# Altium schematic sheet CarrierPeripherals.SchDoc
size A3; SheetNumber: 3; SheetTotal: 3
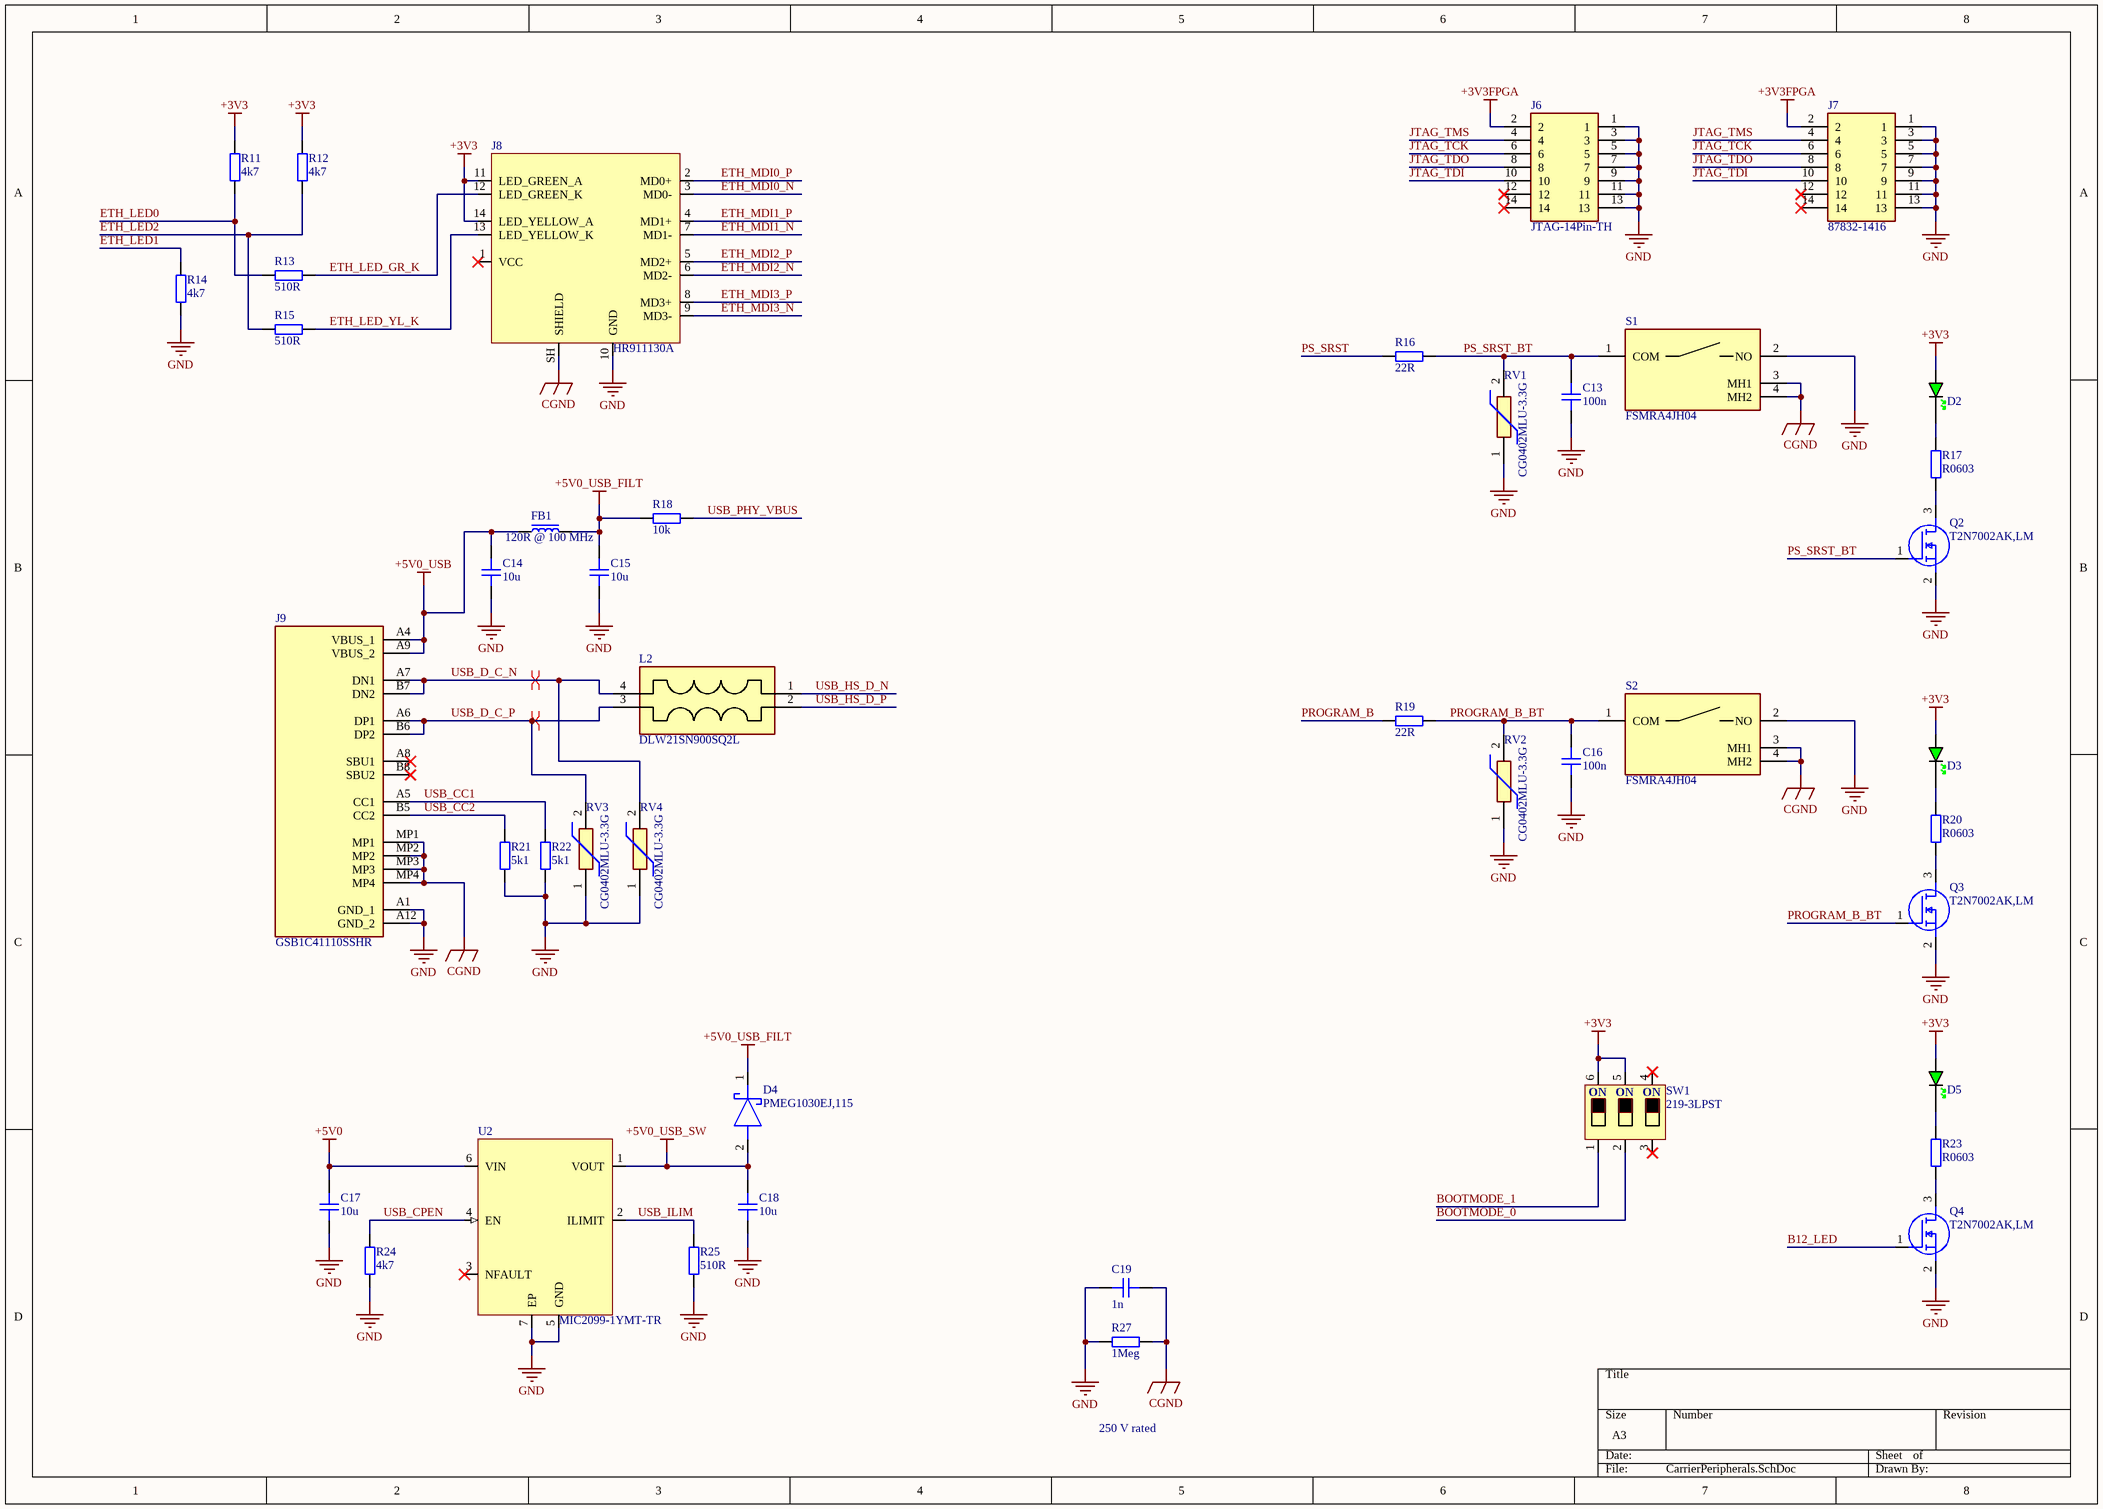
[diagram p0: CarrierPeripherals.SchDoc]

## Parts
C13  100n  [CAP_0402]
C14  10u  [CAP_0603]
C15  10u  [CAP_0603]
C16  100n  [CAP_0402]
C17  10u  [CAP_0603]
C18  10u  [CAP_0603]
C19  1n  [CAP_1206]
D2  GREEN  [LED_0603_GREEN]  (value not drawn)
D3  GREEN  [LED_0603_GREEN]  (value not drawn)
D4  PMEG1030EJ,115  [PMEG1030EJ115]
D5  GREEN  [LED_0603_GREEN]  (value not drawn)
FB1  120R @ 100 MHz  [FB_0603]
J6  JTAG-14Pin-TH  [14Pin-TH]
J7  87832-1416  [878321416]
J8  HR911130A  [HR911130A]
J9  GSB1C41110SSHR  [GSB1C41110SSHR]
L2  DLW21SN900SQ2L  [DLW21SN121HQ2L]
Q2  T2N7002AK,LM  [TBAT54CLM]
Q3  T2N7002AK,LM  [TBAT54CLM]
Q4  T2N7002AK,LM  [TBAT54CLM]
R11  4k7  [RES_0402]
R12  4k7  [RES_0402]
R13  510R  [RES_0603]
R14  4k7  [RES_0402]
R15  510R  [RES_0603]
R16  22R  [RES_0402]
R17  R0603  [RES_0603]
R18  10k  [RES_0402]
R19  22R  [RES_0402]
R20  R0603  [RES_0603]
R21  5k1  [RES_0402]
R22  5k1  [RES_0402]
R23  R0603  [RES_0603]
R24  4k7  [RES_0402]
R25  510R  [RES_0603]
R27  1Meg  [RES_1206]
RV1  CG0402MLU-3.3G  [VARC1005X41N]
RV2  CG0402MLU-3.3G  [VARC1005X41N]
RV3  CG0402MLU-3.3G  [VARC1005X41N]
RV4  CG0402MLU-3.3G  [VARC1005X41N]
S1  FSMRA4JH04  [FSMRA4JH04]
S2  FSMRA4JH04  [FSMRA4JH04]
SW1  219-3LPST  [219-3LPST]
U2  MIC2099-1YMT-TR  [TMLF-6-1_6X1_6]

## Nets
+3V3: D2.A D3.A D5.A J8.11(LED_GREEN_A) J8.14(LED_YELLOW_A) R11.2 R12.2 SW1.5 SW1.6
+3V3FPGA: J6.2 J7.2
+5V0: C17.2 U2.6(VIN)
+5V0_USB: C14.2 FB1.1 J9.A4(VBUS_1) J9.A9(VBUS_2)
+5V0_USB_FILT: C15.2 D4.1(K) FB1.2 R18.1
+5V0_USB_SW: C18.2 D4.2(A) U2.1(VOUT)
CGND: C19.2 J8.SH(SHIELD) J9.MP1 J9.MP2 J9.MP3 J9.MP4 R27.2 S1.3(MH1) S1.4(MH2) S2.3(MH1) S2.4(MH2)
GND: C13.1 C14.1 C15.1 C16.1 C17.1 C18.1 C19.1 J6.1 J6.3 J6.5 J6.7 J6.9 J6.11 J6.13 J7.1 J7.3 J7.5 J7.7 J7.9 J7.11 J7.13 J8.10(GND) J9.A1(GND_1) J9.A12(GND_2) Q2.2(S) Q3.2(S) Q4.2(S) R14.1 R21.1 R22.1 R24.1 R25.1 R27.1 RV1.1 RV2.1 RV3.1 RV4.1 S1.2(NO) S2.2(NO) U2.5(GND) U2.7(EP)
B12_LED: Q4.1(G)
BOOTMODE_0: SW1.2
BOOTMODE_1: SW1.1
ETH_LED0: R11.1 R13.1
ETH_LED1: R14.2
ETH_LED2: R12.1 R15.2
ETH_LED_GR_K: J8.12(LED_GREEN_K) R13.2
ETH_LED_YL_K: J8.13(LED_YELLOW_K) R15.1
ETH_MDI0_N: J8.3(MD0-)
ETH_MDI0_P: J8.2(MD0+)
ETH_MDI1_N: J8.7(MD1-)
ETH_MDI1_P: J8.4(MD1+)
ETH_MDI2_N: J8.6(MD2-)
ETH_MDI2_P: J8.5(MD2+)
ETH_MDI3_N: J8.9(MD3-)
ETH_MDI3_P: J8.8(MD3+)
JTAG_TCK: J6.6 J7.6
JTAG_TDI: J6.10 J7.10
JTAG_TDO: J6.8 J7.8
JTAG_TMS: J6.4 J7.4
PROGRAM_B: R19.2
PROGRAM_B_BT: C16.2 Q3.1(G) R19.1 RV2.2 S2.1(COM)
PS_SRST: R16.2
PS_SRST_BT: C13.2 Q2.1(G) R16.1 RV1.2 S1.1(COM)
USB_CC1: J9.A5(CC1) R22.2
USB_CC2: J9.B5(CC2) R21.2
USB_CPEN: R24.2 U2.4(EN)
USB_D_C_N: J9.A7(DN1) J9.B7(DN2) L2.4 RV4.2
USB_D_C_P: J9.A6(DP1) J9.B6(DP2) L2.3 RV3.2
USB_HS_D_N: L2.1
USB_HS_D_P: L2.2
USB_ILIM: R25.2 U2.2(ILIMIT)
USB_PHY_VBUS: R18.2
NetD2_K: D2.K R17.2
NetD3_K: D3.K R20.2
NetD5_K: D5.K R23.2
NetQ2_3: Q2.3(D) R17.1
NetQ3_3: Q3.3(D) R20.1
NetQ4_3: Q4.3(D) R23.1

Not connected (* = marked no-connect by the designer): J6 12* 14*; J7 12* 14*; J8 1(VCC)*; J9 A8(SBU1)* B8(SBU2)*; SW1 3* 4*; U2 3(NFAULT)*

## Layout directives
differential pair: USB_D_C_N, USB_D_C_P

## Notes on the sheet
- 250 V rated
- (in symbol 219-3LPST) ON

## Library data of the parts
C13 C16 = CAP_0402: Capacitor SMD 0402; Manufacturer: *; Manufacturer Part Number: *; Distributor Link: *; LCSC: *; Rating: *; Dielectric: *
C14 C15 C17 C18 = CAP_0603: Capacitor SMD 0603; Manufacturer: *; Manufacturer Part Number: *; Distributor Link: *; LCSC: *; Rating: *; Dielectric: *
C19 = CAP_1206: Capacitor SMD 1206; Manufacturer: *; Manufacturer Part Number: *; Distributor Link: *; LCSC: *; Rating: *; Dielectric: *
D2 D3 D5 = LED_0603_GREEN: LED 0603 GREEN SMD
D4 = PMEG1030EJ,115: Schottky Diode; Manufacturer_Name: Nexperia; Datasheet Link: https://assets.nexperia.com/documents/data-sheet/PMEG1030EH_EJ.pdf; Height: 0.8mm; Manufacturer_Part_Number: PMEG1030EJ,115; Mouser Part Number: 771-PMEG1030EJ-T/R; Mouser Price/Stock: https://www.mouser.co.uk/ProductDetail/Nexperia/PMEG1030EJ115?qs=LOCUfHb8d9vmk7P%2FuYbs5A%3D%3D; Arrow Part Number: PMEG1030EJ,115; Arrow Price/Stock: https://www.arrow.com/en/products/pmeg1030ej115/nexperia?utm_currency=USD&region=nac
FB1 = FB_0603: Ferrite Bead SMD 0603; Manufacturer: *; Manufacturer Part Number: *; Distributor Link: *; LCSC: *
J6 = JTAG-14Pin-TH: Connector; Manufacturer_Name: Molex; Manufacturer_Part_Number: 87832-1416; Datasheet Link: http://uk.rs-online.com/web/p/products/6701077; Height: 7.6mm; Mouser Part Number: 538-87832-1416; Mouser Price/Stock: https://www.mouser.co.uk/ProductDetail/Molex/87832-1416?qs=kNSQ05%252BLZoDeXuSWsnDgxQ%3D%3D
J7 = 87832-1416: Connector; Manufacturer_Name: Molex; Datasheet Link: http://uk.rs-online.com/web/p/products/6701077; Height: 7.6mm; Manufacturer_Part_Number: 87832-1416; Mouser Part Number: 538-87832-1416; Mouser Price/Stock: https://www.mouser.co.uk/ProductDetail/Molex/87832-1416?qs=kNSQ05%252BLZoDeXuSWsnDgxQ%3D%3D
J8 = HR911130A: 100/1000Base-T Magnetics Single-Port RJ45 Connector with Integrated Magnetics and LEDs; Manufacturer: Hanrun; Manufacturer Part Number: HR911130A
J9 = GSB1C41110SSHR: Connector; Manufacturer_Name: Amphenol Communications Solutions; Datasheet Link: https://cdn.amphenol-cs.com/media/wysiwyg/files/drawing/gsb1c41x10sshr-ax1.pdf; Height: 3.41mm; Manufacturer_Part_Number: GSB1C41110SSHR
L2 = DLW21SN900SQ2L: Inductor; Manufacturer_Name: Murata Electronics; Datasheet Link: https://datasheet.datasheetarchive.com/originals/distributors/Datasheets_SAMA/ece8820704b5ec0ab68e5b2fda1b5649.pdf; Height: 1.4mm; Manufacturer_Part_Number: DLW21SN900SQ2L; Mouser Part Number: 81-DLW21SN900SQ2L; Mouser Price/Stock: https://www.mouser.co.uk/ProductDetail/Murata-Electronics/DLW21SN900SQ2L?qs=yQ3nQrcaeVsNzdZbwxOhwQ%3D%3D; Arrow Part Number: DLW21SN900SQ2L; Arrow Price/Stock: https://www.arrow.com/en/products/dlw21sn900sq2l/murata-manufacturing?region=europe
Q2-Q4 = T2N7002AK,LM: MOSFET (N-Channel); Manufacturer_Name: Toshiba; Datasheet Link: http://toshiba.semicon-storage.com/info/docget.jsp?did=29712&prodName=T2N7002AK; Height: 1.1mm; Manufacturer_Part_Number: T2N7002AK,LM; Mouser Part Number: 757-T2N7002AKLM; Mouser Price/Stock: https://www.mouser.co.uk/ProductDetail/Toshiba/T2N7002AKLM?qs=pzVvXTvk9PzfX4hYglwZ9Q%3D%3D; Arrow Part Number: T2N7002AK,LM; Arrow Price/Stock: https://www.arrow.com/en/products/t2n7002aklm/toshiba?region=nac
R11 R12 R14 R16 R18 R19 R21 R22 R24 = RES_0402: Resistor SMD 0402; Manufacturer: *; Manufacturer Part Number: *; Distributor Link: *; LCSC: *
R13 R15 R17 R20 R23 R25 = RES_0603: Resistor SMD 0603; Manufacturer: *; Manufacturer Part Number: *; Distributor Link: *; LCSC: *
R27 = RES_1206: Resistor SMD 1206; Manufacturer: *; Manufacturer Part Number: *; Distributor Link: *; LCSC: *
RV1-RV4 = CG0402MLU-3.3G: ESD Diode; Manufacturer_Name: Bourns; Datasheet Link: https://www.bourns.com/docs/Product-Datasheets/MLU.pdf; Height: 0.41mm; Manufacturer_Part_Number: CG0402MLU-3.3G; Mouser Part Number: 652-CG0402MLU-3.3G; Mouser Price/Stock: https://www.mouser.co.uk/ProductDetail/Bourns/CG0402MLU-3.3G?qs=m8myXnDJXpWVM8EQWErxtQ%3D%3D; Arrow Part Number: CG0402MLU-3.3G; Arrow Price/Stock: https://www.arrow.com/en/products/cg0402mlu-3.3g/bourns?utm_currency=USD&region=nac
S1 S2 = FSMRA4JH04: Switch; Manufacturer_Name: TE Connectivity; Datasheet Link: http://www.te.com/commerce/DocumentDelivery/DDEController?Action=showdoc&DocId=Customer+Drawing%7F1825027%7FG4%7Fpdf%7FEnglish%7FENG_CD_1825027_G4.pdf%7F1-1825027-1; Height: 7.01mm; Manufacturer_Part_Number: FSMRA4JH04; Mouser Part Number: 506-FSMRA4JH04; Mouser Price/Stock: https://www.mouser.co.uk/ProductDetail/TE-Connectivity-Alcoswitch/FSMRA4JH04?qs=65SUpkGmTbapQKkEnx7SmQ%3D%3D; Arrow Part Number: FSMRA4JH04; Arrow Price/Stock: https://www.arrow.com/en/products/fsmra4jh04/te-connectivity?region=nac
SW1 = 219-3LPST: DIP Switches SPST 3x; Manufacturer: CTS; Manufacturer Part Number: 219-3LPST
U2 = MIC2099-1YMT-TR: Power Distribution Switch Resistor programmable current limit / – 0.1A to 1.1A 2.5V-5.5V; Manufacturer: Microchip; Manufacturer Part Number: MIC2099-1YMT-TR